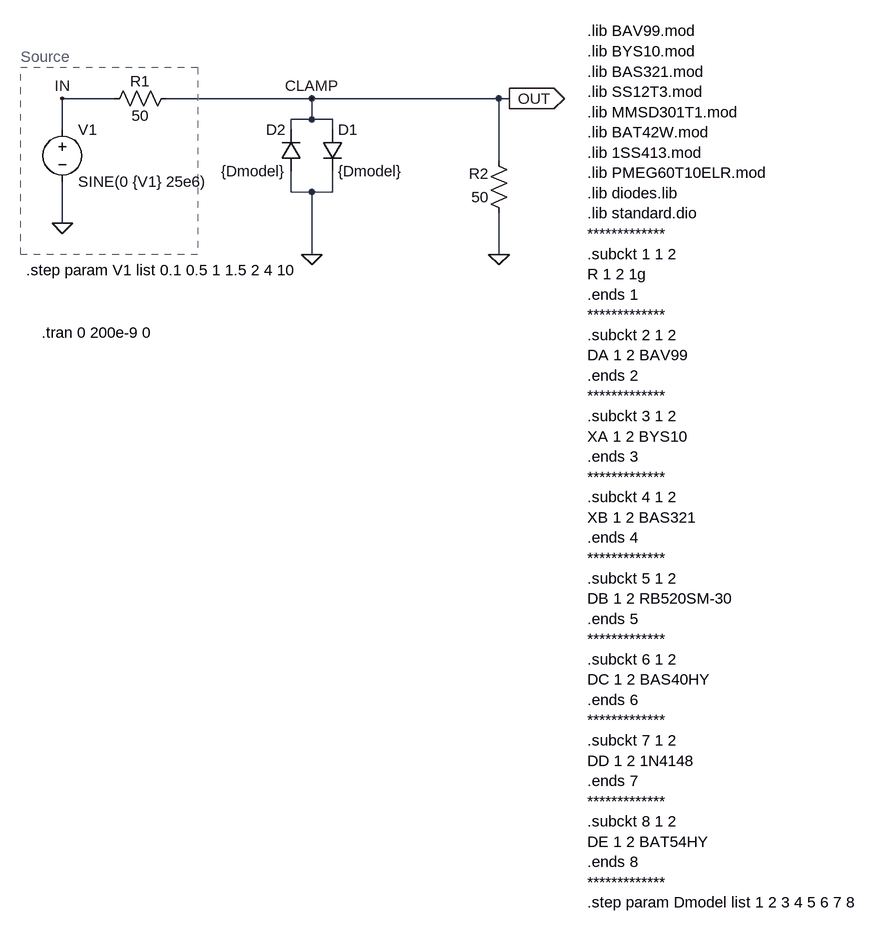
[diagram p0: schematic clamping_diodes.asc]
clamping_diodes.asc, the LTspice schematic file:
Version 4
SHEET 1 1500 1196
WIRE -176 80 -256 80
WIRE 128 80 -96 80
WIRE 416 80 128 80
WIRE 432 80 416 80
WIRE 128 112 128 80
WIRE 128 112 96 112
WIRE 160 112 128 112
WIRE -256 128 -256 80
WIRE 96 128 96 112
WIRE 160 128 160 112
WIRE 416 176 416 80
WIRE 96 224 96 192
WIRE 128 224 96 224
WIRE 160 224 160 192
WIRE 160 224 128 224
WIRE -256 272 -256 208
WIRE 128 320 128 224
WIRE 416 320 416 256
FLAG 128 320 0
FLAG -256 272 0
FLAG 432 80 OUT
IOPIN 432 80 Out
FLAG 416 320 0
FLAG -256 80 IN
FLAG 128 80 CLAMP
SYMBOL diode 144 128 R0
SYMATTR InstName D1
SYMATTR Value {Dmodel}
SYMATTR Prefix X
SYMBOL diode 112 192 R180
WINDOW 0 24 64 Left 2
WINDOW 3 24 0 Left 2
SYMATTR InstName D2
SYMATTR Value {Dmodel}
SYMATTR Prefix X
SYMBOL voltage -256 112 R0
WINDOW 123 0 0 Left 0
WINDOW 39 0 0 Left 0
SYMATTR InstName V1
SYMATTR Value SINE(0 {V1} 25e6)
SYMBOL res -80 64 R90
WINDOW 0 5 56 VBottom 2
WINDOW 3 27 56 VTop 2
SYMATTR InstName R1
SYMATTR Value 50
SYMBOL res 432 272 R180
WINDOW 0 31 76 Left 2
WINDOW 3 31 40 Left 2
SYMATTR InstName R2
SYMATTR Value 50
TEXT -288 440 Left 2 !.tran 0 200e-9 0
TEXT 552 -24 Left 2 !.lib BAV99.mod\n.lib BYS10.mod\n.lib BAS321.mod\n.lib SS12T3.mod\n.lib MMSD301T1.mod\n.lib BAT42W.mod\n.lib 1SS413.mod\n.lib PMEG60T10ELR.mod\n.lib diodes.lib\n.lib standard.dio\n*************\n.subckt 1 1 2\nR 1 2 1g\n.ends 1\n*************\n.subckt 2 1 2\nDA 1 2 BAV99\n.ends 2\n*************\n.subckt 3 1 2\nXA 1 2 BYS10\n.ends 3\n*************\n.subckt 4 1 2\nXB 1 2 BAS321\n.ends 4\n*************\n.subckt 5 1 2\nDB 1 2 RB520SM-30\n.ends 5\n*************\n.subckt 6 1 2\nDC 1 2 BAS40HY\n.ends 6\n*************\n.subckt 7 1 2\nDD 1 2 1N4148\n.ends 7\n*************\n.subckt 8 1 2\nDE 1 2 BAT54HY\n.ends 8\n*************\n.step param Dmodel list 1 2 3 4 5 6 7 8
TEXT -320 16 Left 2 ;Source
TEXT -312 344 Left 2 !.step param V1 list 0.1 0.5 1 1.5 2 4 10
RECTANGLE Normal -48 320 -320 32 1

The netlist it stands for:
* clamping_diodes.asc
XD1 CLAMP 0 {Dmodel}  ; pins + -
XD2 0 CLAMP {Dmodel}  ; pins + -
V1 IN 0 SINE(0 {V1} 25e6)
R1 CLAMP IN 50
R2 0 CLAMP 50
.tran 0 200e-9 0
.lib BAV99.mod
.lib BYS10.mod
.lib BAS321.mod
.lib SS12T3.mod
.lib MMSD301T1.mod
.lib BAT42W.mod
.lib 1SS413.mod
.lib PMEG60T10ELR.mod
.lib diodes.lib
.lib standard.dio
*************
.subckt 1 1 2
R 1 2 1g
.ends 1
*************
.subckt 2 1 2
DA 1 2 BAV99
.ends 2
*************
.subckt 3 1 2
XA 1 2 BYS10
.ends 3
*************
.subckt 4 1 2
XB 1 2 BAS321
.ends 4
*************
.subckt 5 1 2
DB 1 2 RB520SM-30
.ends 5
*************
.subckt 6 1 2
DC 1 2 BAS40HY
.ends 6
*************
.subckt 7 1 2
DD 1 2 1N4148
.ends 7
*************
.subckt 8 1 2
DE 1 2 BAT54HY
.ends 8
*************
.step param Dmodel list 1 2 3 4 5 6 7 8
* Source
.step param V1 list 0.1 0.5 1 1.5 2 4 10
.backanno
.end